# Altium project RK_MEGAPLATA.PrjPcb (part 9 of 9)
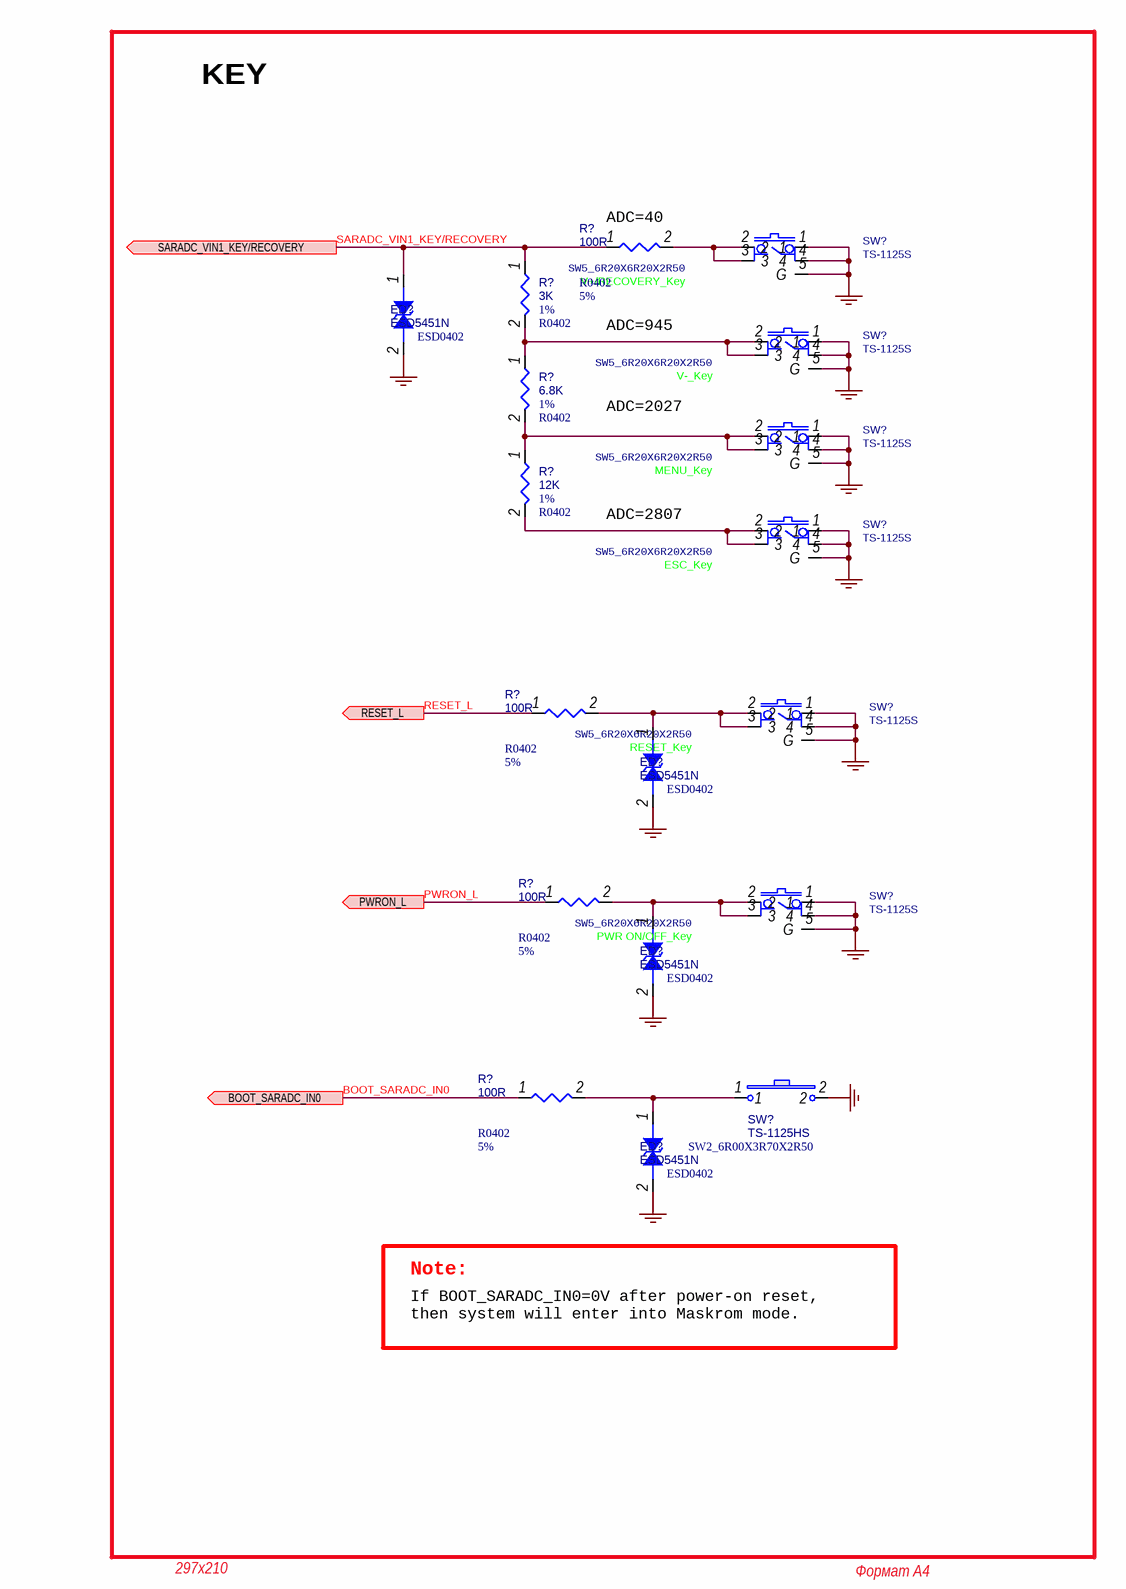
[diagram p29: BUTTON.SchDoc]

## Nets that join several sheets
(0.75-0.85V): RK3588_DDR (C?#30.1 C?#34.1 U?#3.N12 U?#4.L15), POWER_RK806 (C?#121.1 U?#23.12)
GND: RK3588_OSC_PLL (19 pins), RK3588_DDR (33 pins), RK3588_FLASH_SD_EMMC (C?#45.2 C?#46.2 C?#47.2), RK3588_TYPE_C (13 pins), RK3588_BOOTLOADER_MAYBE_SDIO (7 pins), RK3588_MIPI (9 pins), RK3588_HDMI (C?#74.2 C?#75.2 C?#76.2 R?#28.2), RK3588_GPIO_MAYBE_IMPORTANT_PINS (5 pins), UART_DEBUG (C?#82.2 ED?#1.2 ED?#2.2 J?#1.1), POWER_IN_TYPE_C (13 pins), POWER_RK806 (122 pins), PORT_TYPE_C (32 pins), DRAM_LPDDR4X_200P_2X32bit (204 pins), FLASH_EMMC (22 pins), FLASH_SD_CARD (16 pins), SD_CARD_SDIO (14 pins), HDMI2_0_RX (22 pins), MIPI_D_CPHY_TX_DUAL (33 pins), ETHERNET_PHY_RGMII (49 pins), BUTTON (23 pins)
VCC1V8_PMU_DDR_S3: RK3588_OSC_PLL (C?#8.1 C?#12.1 U?#1.N28 U?#2.R27), POWER_RK806 (R?#50.1 R?#51.1), DRAM_LPDDR4X_200P_2X32bit (34 pins), FLASH_SD_CARD (R?#113.2)
VCC_1V8_S0: RK3588_FLASH_SD_EMMC (C?#46.1 U?#6.AA7), RK3588_BOOTLOADER_MAYBE_SDIO (C?#63.1 C?#64.1 U?#9.G20 U?#11.Y26), RK3588_MIPI (C?#72.1 C?#73.1 U?#12.AJ20 U?#13.AJ19), RK3588_GPIO_MAYBE_IMPORTANT_PINS (7 pins), POWER_RK806 (C?#100.1 R?#54.1 U?#23.58), HDMI2_0_RX (R?#147.1), MIPI_D_CPHY_TX_DUAL (R?#161.1)
VCC_1V8_S3: RK3588_FLASH_SD_EMMC (C?#45.1 U?#5.V26), POWER_RK806 (7 pins), FLASH_EMMC (13 pins), SD_CARD_SDIO (10 pins)
VCC_3V3_S0: RK3588_GPIO_MAYBE_IMPORTANT_PINS (C?#78.1 C?#80.1 U?#19.AC26 U?#20.W26), POWER_RK806 (C?#148.1 U?#24.1), HDMI2_0_RX (7 pins), ETHERNET_PHY_RGMII (R?#191.1 R?#196.1)
VCC_3V3_S3: RK3588_OSC_PLL (8 pins), UART_DEBUG (C?#82.1 J?#1.4), POWER_RK806 (7 pins), PORT_TYPE_C (C?#197.1 R?#84.1 U?#32.3 U?#32.4), FLASH_EMMC (7 pins), FLASH_SD_CARD (C?#298.1 Q?#1.2 R?#110.1), MIPI_D_CPHY_TX_DUAL (C?#310.1 U?#40.5)
VCC_5V0: POWER_IN_TYPE_C (7 pins), POWER_RK806 (47 pins), PORT_TYPE_C (7 pins)
VCCA_1V8_S0: RK3588_OSC_PLL (5 pins), RK3588_DDR (C?#29.1 C?#33.1 U?#3.M12 U?#4.K16), RK3588_TYPE_C (8 pins), RK3588_BOOTLOADER_MAYBE_SDIO (C?#61.1 R?#24.2 R?#25.1 U?#10.AH18), POWER_RK806 (C?#98.1 U?#23.60)
VCCA_3V3_S0: RK3588_TYPE_C (C?#54.1 U?#8.AJ10), RK3588_HDMI (C?#75.1 C?#76.1 U?#18.AE4 U?#18.AE5), POWER_RK806 (C?#111.1 U?#23.63), PORT_TYPE_C (R?#81.2)
VCCIO_SD_S0: RK3588_FLASH_SD_EMMC (C?#47.1 U?#6.Y7), POWER_RK806 (C?#113.1 U?#23.65), FLASH_SD_CARD (6 pins)
VDD2_DDR_S3: POWER_RK806 (7 pins), DRAM_LPDDR4X_200P_2X32bit (84 pins)
VDD_0V75_S0: RK3588_OSC_PLL (C?#6.1 C?#7.1 U?#1.V20), RK3588_BOOTLOADER_MAYBE_SDIO (C?#62.1 U?#10.AD3), RK3588_MIPI (5 pins), POWER_RK806 (C?#131.1 U?#23.8)
VDD_0V75_S3: RK3588_OSC_PLL (C?#10.1 C?#11.1 U?#1.P27), POWER_RK806 (C?#116.1 U?#23.14)
VDD_DDR_S0: RK3588_DDR (22 pins), POWER_RK806 (9 pins)
VDDA_0V75_S0: RK3588_TYPE_C (C?#52.1 U?#8.AH10), RK3588_HDMI (C?#74.1 U?#18.AE8), POWER_RK806 (C?#128.1 U?#23.11)
VDDA_0V85_S0: RK3588_TYPE_C (8 pins), POWER_RK806 (C?#129.1 U?#23.10)
VDDA_1V2_S0: RK3588_MIPI (C?#70.1 C?#71.1 U?#12.AH20 U?#13.AH19), POWER_RK806 (C?#110.1 U?#23.57)
VDDQ_DDR_CK_S0: RK3588_DDR (5 pins), DRAM_LPDDR4X_200P_2X32bit (R?#93.1)
VDDQ_DDR_CKE_S3: RK3588_DDR (C?#31.1 C?#32.1 U?#3.N8 U?#4.H13), DRAM_LPDDR4X_200P_2X32bit (R?#96.1)
VDDQ_DDR_S0: RK3588_DDR (26 pins), POWER_RK806 (7 pins), DRAM_LPDDR4X_200P_2X32bit (R?#91.2 R?#93.2)
BOOT_SARADC_IN0: RK3588_BOOTLOADER_MAYBE_SDIO (C?#59.1 R?#25.2 R?#26.1 U?#10.AM16), BUTTON (R?#214.1)
CC_INT_L: RK3588_OSC_PLL (U?#2.U33), PORT_TYPE_C (R?#84.2 U?#32.5)
CPU_BIG0_VSEL: RK3588_OSC_PLL (U?#1.R31), POWER_RK806 (U?#25.A1)
CPU_BIG1_VSEL: RK3588_OSC_PLL (U?#2.W28), POWER_RK806 (U?#29.A1)
DDR_RESET: RK3588_DDR (U?#3.T4), DRAM_LPDDR4X_200P_2X32bit (C?#243.1 C?#287.1 U?#35.T11 U?#37.T11)
eMMC_RSTn: RK3588_FLASH_SD_EMMC (U?#5.AA34), FLASH_EMMC (R?#107.2 U?#39.K5)
ETH1_REFCLKO_25M: RK3588_GPIO_MAYBE_IMPORTANT_PINS (U?#20.AH27), ETHERNET_PHY_RGMII (R?#174.1)
GMAC1_MCLKINOUT: RK3588_GPIO_MAYBE_IMPORTANT_PINS (R?#35.2), ETHERNET_PHY_RGMII (C?#316.1 R?#176.1 R?#177.1)
GMAC1_MDC: RK3588_GPIO_MAYBE_IMPORTANT_PINS (U?#20.Y31), ETHERNET_PHY_RGMII (U?#41.13)
GMAC1_MDIO: RK3588_GPIO_MAYBE_IMPORTANT_PINS (R?#36.2), ETHERNET_PHY_RGMII (R?#199.2 U?#41.14)
GMAC1_RSTn_L: RK3588_GPIO_MAYBE_IMPORTANT_PINS (U?#20.AA28), ETHERNET_PHY_RGMII (R?#201.1)
GMAC1_RXCLK: RK3588_GPIO_MAYBE_IMPORTANT_PINS (U?#20.AH30), ETHERNET_PHY_RGMII (C?#335.1 R?#206.2)
GMAC1_RXD0: RK3588_GPIO_MAYBE_IMPORTANT_PINS (U?#20.AG29), ETHERNET_PHY_RGMII (R?#202.2)
GMAC1_RXD1: RK3588_GPIO_MAYBE_IMPORTANT_PINS (U?#20.AG28), ETHERNET_PHY_RGMII (R?#203.2)
GMAC1_RXD2: RK3588_GPIO_MAYBE_IMPORTANT_PINS (U?#20.AD27), ETHERNET_PHY_RGMII (R?#204.2)
GMAC1_RXD3: RK3588_GPIO_MAYBE_IMPORTANT_PINS (U?#20.AE27), ETHERNET_PHY_RGMII (R?#205.2)
GMAC1_RXDV_CRS: RK3588_GPIO_MAYBE_IMPORTANT_PINS (U?#20.AH29), ETHERNET_PHY_RGMII (R?#207.2)
GMAC1_TXCLK: RK3588_GPIO_MAYBE_IMPORTANT_PINS (R?#31.2), ETHERNET_PHY_RGMII (C?#325.1 U?#41.20)
GMAC1_TXD0: RK3588_GPIO_MAYBE_IMPORTANT_PINS (R?#32.2), ETHERNET_PHY_RGMII (U?#41.18)
GMAC1_TXD1: RK3588_GPIO_MAYBE_IMPORTANT_PINS (R?#33.2), ETHERNET_PHY_RGMII (U?#41.17)
GMAC1_TXD2: RK3588_GPIO_MAYBE_IMPORTANT_PINS (R?#29.2), ETHERNET_PHY_RGMII (U?#41.16)
GMAC1_TXD3: RK3588_GPIO_MAYBE_IMPORTANT_PINS (R?#30.2), ETHERNET_PHY_RGMII (U?#41.15)
GMAC1_TXEN: RK3588_GPIO_MAYBE_IMPORTANT_PINS (R?#34.2), ETHERNET_PHY_RGMII (U?#41.19)
HDMI_RX_CEC: RK3588_GPIO_MAYBE_IMPORTANT_PINS (U?#20.AG23), HDMI2_0_RX (Q?#7.2 R?#158.2)
HDMI_RX_SCL_M1: RK3588_GPIO_MAYBE_IMPORTANT_PINS (U?#20.AG25), HDMI2_0_RX (Q?#4.2 R?#150.2)
HDMI_RX_SDA_M1: RK3588_GPIO_MAYBE_IMPORTANT_PINS (U?#20.AG24), HDMI2_0_RX (Q?#6.2 R?#155.2)
HDMIIRX_DET_L: RK3588_BOOTLOADER_MAYBE_SDIO (U?#9.G26), HDMI2_0_RX (Q?#3.3 R?#147.2)
HDMIIRX_HPDOUT_H: RK3588_GPIO_MAYBE_IMPORTANT_PINS (U?#20.AA27), HDMI2_0_RX (R?#154.1)
I2C0_SCL_M2: RK3588_OSC_PLL (R?#8.2 U?#2.W30), POWER_RK806 (U?#25.A3 U?#29.A3)
I2C0_SDA_M2: RK3588_OSC_PLL (R?#7.2 U?#2.W29), POWER_RK806 (U?#25.B1 U?#29.B1)
I2C1_SCL_M2: RK3588_OSC_PLL (R?#13.2 U?#2.V29), POWER_RK806 (U?#26.A3)
I2C1_SDA_M2: RK3588_OSC_PLL (R?#12.2 U?#2.V28), POWER_RK806 (U?#26.B1)
I2C6_SCL_M0: RK3588_OSC_PLL (R?#15.2 U?#2.W31), PORT_TYPE_C (U?#32.6)
I2C6_SDA_M0: RK3588_OSC_PLL (R?#14.2 U?#2.V31), PORT_TYPE_C (U?#32.7)
LCD_PWREN_H: RK3588_GPIO_MAYBE_IMPORTANT_PINS (U?#21.D27), MIPI_D_CPHY_TX_DUAL (R?#162.1 R?#164.1 U?#40.4)
MIPI_DPHY0_TX_CLKN: RK3588_MIPI (U?#12.AP26), MIPI_D_CPHY_TX_DUAL (J?#7.54)
MIPI_DPHY0_TX_CLKP: RK3588_MIPI (U?#12.AN26), MIPI_D_CPHY_TX_DUAL (J?#7.53)
MIPI_DPHY0_TX_D0N: RK3588_MIPI (U?#12.AP24), MIPI_D_CPHY_TX_DUAL (J?#7.57)
MIPI_DPHY0_TX_D0P: RK3588_MIPI (U?#12.AN24), MIPI_D_CPHY_TX_DUAL (J?#7.56)
MIPI_DPHY0_TX_D1N: RK3588_MIPI (U?#12.AP25), MIPI_D_CPHY_TX_DUAL (J?#7.51)
MIPI_DPHY0_TX_D1P: RK3588_MIPI (U?#12.AN25), MIPI_D_CPHY_TX_DUAL (J?#7.50)
MIPI_DPHY0_TX_D2N: RK3588_MIPI (U?#12.AP27), MIPI_D_CPHY_TX_DUAL (J?#7.48)
MIPI_DPHY0_TX_D2P: RK3588_MIPI (U?#12.AN27), MIPI_D_CPHY_TX_DUAL (J?#7.47)
MIPI_DPHY0_TX_D3N: RK3588_MIPI (U?#12.AP28), MIPI_D_CPHY_TX_DUAL (J?#7.60)
MIPI_DPHY0_TX_D3P: RK3588_MIPI (U?#12.AN28), MIPI_D_CPHY_TX_DUAL (J?#7.59)
MIPI_DPHY1_TX_CLKN: RK3588_MIPI (U?#13.AP20), MIPI_D_CPHY_TX_DUAL (J?#7.24)
MIPI_DPHY1_TX_CLKP: RK3588_MIPI (U?#13.AN20), MIPI_D_CPHY_TX_DUAL (J?#7.23)
MIPI_DPHY1_TX_D0N: RK3588_MIPI (U?#13.AP18), MIPI_D_CPHY_TX_DUAL (J?#7.27)
MIPI_DPHY1_TX_D0P: RK3588_MIPI (U?#13.AN18), MIPI_D_CPHY_TX_DUAL (J?#7.26)
MIPI_DPHY1_TX_D1N: RK3588_MIPI (U?#13.AP19), MIPI_D_CPHY_TX_DUAL (J?#7.21)
MIPI_DPHY1_TX_D1P: RK3588_MIPI (U?#13.AN19), MIPI_D_CPHY_TX_DUAL (J?#7.20)
MIPI_DPHY1_TX_D2N: RK3588_MIPI (U?#13.AP21), MIPI_D_CPHY_TX_DUAL (J?#7.18)
MIPI_DPHY1_TX_D2P: RK3588_MIPI (U?#13.AN21), MIPI_D_CPHY_TX_DUAL (J?#7.17)
MIPI_DPHY1_TX_D3N: RK3588_MIPI (U?#13.AP22), MIPI_D_CPHY_TX_DUAL (J?#7.30)
MIPI_DPHY1_TX_D3P: RK3588_MIPI (U?#13.AN22), MIPI_D_CPHY_TX_DUAL (J?#7.29)
NetC?#185_1: RK3588_TYPE_C (U?#7.AL15), PORT_TYPE_C (C?#185.1)
NetC?#186_1: RK3588_TYPE_C (U?#7.AM15), PORT_TYPE_C (C?#186.1)
NetC?#187_1: RK3588_TYPE_C (U?#7.AN14), PORT_TYPE_C (C?#187.1)
NetC?#188_1: RK3588_TYPE_C (U?#7.AP14), PORT_TYPE_C (C?#188.1)
NetC?#189_1: RK3588_TYPE_C (U?#7.AN16), PORT_TYPE_C (C?#189.1)
NetC?#190_1: RK3588_TYPE_C (U?#7.AP16), PORT_TYPE_C (C?#190.1)
NetC?#293_1: RK3588_FLASH_SD_EMMC (R?#20.2), FLASH_EMMC (C?#293.1 U?#39.M6)
NetD?#6_1: RK3588_FLASH_SD_EMMC (R?#21.2), FLASH_SD_CARD (D?#6.1 J?#4.5 R?#116.1)
NetD?#10_1: RK3588_BOOTLOADER_MAYBE_SDIO (U?#11.AE32), SD_CARD_SDIO (D?#10.1 R?#133.1)
NetD?#11_1: RK3588_BOOTLOADER_MAYBE_SDIO (U?#11.AC33), SD_CARD_SDIO (D?#11.1 R?#134.1)
NetD?#12_1: RK3588_BOOTLOADER_MAYBE_SDIO (U?#11.AC34), SD_CARD_SDIO (D?#12.1 R?#135.1)
NetD?#13_1: RK3588_BOOTLOADER_MAYBE_SDIO (R?#27.2), SD_CARD_SDIO (D?#13.1 J?#5.5 R?#129.1)
NetD?#14_1: RK3588_BOOTLOADER_MAYBE_SDIO (U?#11.AC32), SD_CARD_SDIO (D?#14.1 R?#128.1 R?#136.1)
NetD?#15_1: RK3588_BOOTLOADER_MAYBE_SDIO (U?#11.AC31), SD_CARD_SDIO (D?#15.1 R?#127.1 R?#137.1)
NetD?#16_1: RK3588_BOOTLOADER_MAYBE_SDIO (U?#11.AB31), SD_CARD_SDIO (D?#16.1 J?#5.9 R?#126.1)
NetR?#37_1: RK3588_OSC_PLL (U?#2.R29), UART_DEBUG (R?#37.1)
NetR?#38_1: RK3588_OSC_PLL (U?#2.P29), UART_DEBUG (R?#38.1)
NetR?#69_1: RK3588_GPIO_MAYBE_IMPORTANT_PINS (U?#19.AL27), PORT_TYPE_C (R?#69.1)
NetR?#72_1: RK3588_GPIO_MAYBE_IMPORTANT_PINS (U?#19.AM27), PORT_TYPE_C (R?#72.1)
NetR?#73_1: RK3588_TYPE_C (U?#8.AM12), PORT_TYPE_C (R?#73.1)
NetR?#75_1: RK3588_TYPE_C (U?#8.AL12), PORT_TYPE_C (R?#75.1)
NetR?#77_1: RK3588_TYPE_C (U?#7.AP13), PORT_TYPE_C (R?#77.1)
NetR?#78_1: RK3588_TYPE_C (U?#7.AN13), PORT_TYPE_C (R?#78.1)
NetR?#79_1: RK3588_TYPE_C (U?#7.AP15), PORT_TYPE_C (R?#79.1)
NetR?#80_1: RK3588_TYPE_C (U?#7.AN15), PORT_TYPE_C (R?#80.1)
NetR?#81_1: RK3588_TYPE_C (U?#8.AM14), PORT_TYPE_C (R?#81.1)
NetR?#82_1: RK3588_GPIO_MAYBE_IMPORTANT_PINS (U?#19.AL30), PORT_TYPE_C (R?#82.1 U?#33.4)
NetR?#85_1: RK3588_DDR (U?#3.P7), DRAM_LPDDR4X_200P_2X32bit (R?#85.1)
NetR?#86_1: RK3588_DDR (U?#3.N7), DRAM_LPDDR4X_200P_2X32bit (R?#86.1)
NetR?#87_1: RK3588_DDR (U?#3.L5), DRAM_LPDDR4X_200P_2X32bit (R?#87.1)
NetR?#88_1: RK3588_DDR (U?#3.L4), DRAM_LPDDR4X_200P_2X32bit (R?#88.1)
NetR?#97_1: RK3588_DDR (U?#4.D11), DRAM_LPDDR4X_200P_2X32bit (R?#97.1)
NetR?#98_1: RK3588_DDR (U?#4.E11), DRAM_LPDDR4X_200P_2X32bit (R?#98.1)
NetR?#99_1: RK3588_DDR (U?#4.D16), DRAM_LPDDR4X_200P_2X32bit (R?#99.1)
NetR?#100_1: RK3588_DDR (U?#4.E16), DRAM_LPDDR4X_200P_2X32bit (R?#100.1)
NetR?#108_1: RK3588_FLASH_SD_EMMC (U?#5.Y34), FLASH_EMMC (R?#108.1)
NetR?#138_2: RK3588_HDMI (U?#18.AF5), HDMI2_0_RX (R?#138.2)
NetR?#139_2: RK3588_HDMI (U?#18.AF6), HDMI2_0_RX (R?#139.2)
NetR?#140_2: RK3588_HDMI (U?#18.AG4), HDMI2_0_RX (R?#140.2)
NetR?#141_2: RK3588_HDMI (U?#18.AG5), HDMI2_0_RX (R?#141.2)
NetR?#142_2: RK3588_HDMI (U?#18.AH5), HDMI2_0_RX (R?#142.2)
NetR?#143_2: RK3588_HDMI (U?#18.AH6), HDMI2_0_RX (R?#143.2)
NetR?#144_2: RK3588_HDMI (U?#18.AJ4), HDMI2_0_RX (R?#144.2)
NetR?#145_2: RK3588_HDMI (U?#18.AJ5), HDMI2_0_RX (R?#145.2)
NetU?#3_AA1: RK3588_DDR (U?#3.AA1), DRAM_LPDDR4X_200P_2X32bit (U?#35.C9)
NetU?#3_AA2: RK3588_DDR (U?#3.AA2), DRAM_LPDDR4X_200P_2X32bit (U?#35.B9)
NetU?#3_AA4: RK3588_DDR (U?#3.AA4), DRAM_LPDDR4X_200P_2X32bit (U?#35.E10)
NetU?#3_AA5: RK3588_DDR (U?#3.AA5), DRAM_LPDDR4X_200P_2X32bit (U?#35.D10)
NetU?#3_AB1: RK3588_DDR (U?#3.AB1), DRAM_LPDDR4X_200P_2X32bit (U?#35.C11)
NetU?#3_AB2: RK3588_DDR (U?#3.AB2), DRAM_LPDDR4X_200P_2X32bit (U?#35.B11)
NetU?#3_AB4: RK3588_DDR (U?#3.AB4), DRAM_LPDDR4X_200P_2X32bit (U?#35.C10)
NetU?#3_AC1: RK3588_DDR (U?#3.AC1), DRAM_LPDDR4X_200P_2X32bit (U?#35.E11)
NetU?#3_AC2: RK3588_DDR (U?#3.AC2), DRAM_LPDDR4X_200P_2X32bit (U?#35.F11)
NetU?#3_B1: RK3588_DDR (U?#3.B1), DRAM_LPDDR4X_200P_2X32bit (U?#35.U11)
NetU?#3_C1: RK3588_DDR (U?#3.C1), DRAM_LPDDR4X_200P_2X32bit (U?#35.Y11)
NetU?#3_C2: RK3588_DDR (U?#3.C2), DRAM_LPDDR4X_200P_2X32bit (U?#35.V11)
NetU?#3_D1: RK3588_DDR (U?#3.D1), DRAM_LPDDR4X_200P_2X32bit (U?#35.AA9)
NetU?#3_D2: RK3588_DDR (U?#3.D2), DRAM_LPDDR4X_200P_2X32bit (U?#35.AA11)
NetU?#3_E1: RK3588_DDR (U?#3.E1), DRAM_LPDDR4X_200P_2X32bit (U?#35.V9)
NetU?#3_E2: RK3588_DDR (U?#3.E2), DRAM_LPDDR4X_200P_2X32bit (U?#35.Y9)
NetU?#3_E4: RK3588_DDR (U?#3.E4), DRAM_LPDDR4X_200P_2X32bit (U?#35.Y10)
NetU?#3_F1: RK3588_DDR (U?#3.F1), DRAM_LPDDR4X_200P_2X32bit (U?#35.U4)
NetU?#3_F2: RK3588_DDR (U?#3.F2), DRAM_LPDDR4X_200P_2X32bit (U?#35.U9)
NetU?#3_F4: RK3588_DDR (U?#3.F4), DRAM_LPDDR4X_200P_2X32bit (U?#35.V10)
NetU?#3_F5: RK3588_DDR (U?#3.F5), DRAM_LPDDR4X_200P_2X32bit (U?#35.W10)
NetU?#3_G1: RK3588_DDR (U?#3.G1), DRAM_LPDDR4X_200P_2X32bit (U?#35.Y4)
NetU?#3_G2: RK3588_DDR (U?#3.G2), DRAM_LPDDR4X_200P_2X32bit (U?#35.V4)
NetU?#3_G4: RK3588_DDR (U?#3.G4), DRAM_LPDDR4X_200P_2X32bit (U?#35.Y3)
NetU?#3_H1: RK3588_DDR (U?#3.H1), DRAM_LPDDR4X_200P_2X32bit (U?#35.AA2)
NetU?#3_H2: RK3588_DDR (U?#3.H2), DRAM_LPDDR4X_200P_2X32bit (U?#35.AA4)
NetU?#3_J1: RK3588_DDR (U?#3.J1), DRAM_LPDDR4X_200P_2X32bit (U?#35.V2)
NetU?#3_J2: RK3588_DDR (U?#3.J2), DRAM_LPDDR4X_200P_2X32bit (U?#35.Y2)
NetU?#3_J7: RK3588_DDR (U?#3.J7), DRAM_LPDDR4X_200P_2X32bit (U?#35.V3)
NetU?#3_J8: RK3588_DDR (U?#3.J8), DRAM_LPDDR4X_200P_2X32bit (U?#35.W3)
NetU?#3_K1: RK3588_DDR (U?#3.K1), DRAM_LPDDR4X_200P_2X32bit (U?#35.R11)
NetU?#3_K2: RK3588_DDR (U?#3.K2), DRAM_LPDDR4X_200P_2X32bit (U?#35.U2)
NetU?#3_L2: RK3588_DDR (U?#3.L2), DRAM_LPDDR4X_200P_2X32bit (U?#35.P11)
NetU?#3_L7: RK3588_DDR (U?#3.L7), DRAM_LPDDR4X_200P_2X32bit (U?#35.R4)
NetU?#3_L8: RK3588_DDR (U?#3.L8), DRAM_LPDDR4X_200P_2X32bit (U?#35.R3)
NetU?#3_M1: RK3588_DDR (U?#3.M1), DRAM_LPDDR4X_200P_2X32bit (U?#35.P9)
NetU?#3_M2: RK3588_DDR (U?#3.M2), DRAM_LPDDR4X_200P_2X32bit (U?#35.P8)
NetU?#3_M5: RK3588_DDR (U?#3.M5), DRAM_LPDDR4X_200P_2X32bit (U?#35.P2)
NetU?#3_M8: RK3588_DDR (U?#3.M8), DRAM_LPDDR4X_200P_2X32bit (U?#35.R2)
NetU?#3_N1: RK3588_DDR (U?#3.N1), DRAM_LPDDR4X_200P_2X32bit (U?#35.J9)
NetU?#3_N2: RK3588_DDR (U?#3.N2), DRAM_LPDDR4X_200P_2X32bit (U?#35.J8)
NetU?#3_N4: RK3588_DDR (U?#3.N4), DRAM_LPDDR4X_200P_2X32bit (U?#35.R10)
NetU?#3_N5: RK3588_DDR (U?#3.N5), DRAM_LPDDR4X_200P_2X32bit (U?#35.R9)
NetU?#3_P2: RK3588_DDR (U?#3.P2), DRAM_LPDDR4X_200P_2X32bit (U?#35.J11)
NetU?#3_P4: RK3588_DDR (U?#3.P4), DRAM_LPDDR4X_200P_2X32bit (U?#35.H9)
NetU?#3_P5: RK3588_DDR (U?#3.P5), DRAM_LPDDR4X_200P_2X32bit (U?#35.H10)
NetU?#3_R1: RK3588_DDR (U?#3.R1), DRAM_LPDDR4X_200P_2X32bit (U?#35.H11)
NetU?#3_R2: RK3588_DDR (U?#3.R2), DRAM_LPDDR4X_200P_2X32bit (U?#35.F2)
NetU?#3_R6: RK3588_DDR (U?#3.R6), DRAM_LPDDR4X_200P_2X32bit (U?#35.H4)
NetU?#3_R7: RK3588_DDR (U?#3.R7), DRAM_LPDDR4X_200P_2X32bit (U?#35.H3)
NetU?#3_T1: RK3588_DDR (U?#3.T1), DRAM_LPDDR4X_200P_2X32bit (U?#35.E2)
NetU?#3_T2: RK3588_DDR (U?#3.T2), DRAM_LPDDR4X_200P_2X32bit (U?#35.C2)
NetU?#3_T7: RK3588_DDR (U?#3.T7), DRAM_LPDDR4X_200P_2X32bit (U?#35.H2)
NetU?#3_T8: RK3588_DDR (U?#3.T8), DRAM_LPDDR4X_200P_2X32bit (U?#35.J2)
NetU?#3_U1: RK3588_DDR (U?#3.U1), DRAM_LPDDR4X_200P_2X32bit (U?#35.B2)
NetU?#3_U2: RK3588_DDR (U?#3.U2), DRAM_LPDDR4X_200P_2X32bit (U?#35.B4)
NetU?#3_U4: RK3588_DDR (U?#3.U4), DRAM_LPDDR4X_200P_2X32bit (U?#35.E3)
NetU?#3_U5: RK3588_DDR (U?#3.U5), DRAM_LPDDR4X_200P_2X32bit (U?#35.D3)
NetU?#3_V1: RK3588_DDR (U?#3.V1), DRAM_LPDDR4X_200P_2X32bit (U?#35.C4)
NetU?#3_V2: RK3588_DDR (U?#3.V2), DRAM_LPDDR4X_200P_2X32bit (U?#35.E4)
NetU?#3_W1: RK3588_DDR (U?#3.W1), DRAM_LPDDR4X_200P_2X32bit (U?#35.F4)
NetU?#3_Y1: RK3588_DDR (U?#3.Y1), DRAM_LPDDR4X_200P_2X32bit (U?#35.F9)
NetU?#3_Y2: RK3588_DDR (U?#3.Y2), DRAM_LPDDR4X_200P_2X32bit (U?#35.E9)
NetU?#3_Y4: RK3588_DDR (U?#3.Y4), DRAM_LPDDR4X_200P_2X32bit (U?#35.C3)
NetU?#4_A2: RK3588_DDR (U?#4.A2), DRAM_LPDDR4X_200P_2X32bit (U?#37.E11)
NetU?#4_A3: RK3588_DDR (U?#4.A3), DRAM_LPDDR4X_200P_2X32bit (U?#37.B11)
NetU?#4_A4: RK3588_DDR (U?#4.A4), DRAM_LPDDR4X_200P_2X32bit (U?#37.C9)
NetU?#4_A5: RK3588_DDR (U?#4.A5), DRAM_LPDDR4X_200P_2X32bit (U?#37.F9)
NetU?#4_A6: RK3588_DDR (U?#4.A6), DRAM_LPDDR4X_200P_2X32bit (U?#37.F4)
NetU?#4_A7: RK3588_DDR (U?#4.A7), DRAM_LPDDR4X_200P_2X32bit (U?#37.C4)
NetU?#4_A8: RK3588_DDR (U?#4.A8), DRAM_LPDDR4X_200P_2X32bit (U?#37.B2)
NetU?#4_A9: RK3588_DDR (U?#4.A9), DRAM_LPDDR4X_200P_2X32bit (U?#37.E2)
NetU?#4_A10: RK3588_DDR (U?#4.A10), DRAM_LPDDR4X_200P_2X32bit (U?#37.H11)
NetU?#4_A12: RK3588_DDR (U?#4.A12), DRAM_LPDDR4X_200P_2X32bit (U?#37.J9)
NetU?#4_A13: RK3588_DDR (U?#4.A13), DRAM_LPDDR4X_200P_2X32bit (U?#37.P9)
NetU?#4_A15: RK3588_DDR (U?#4.A15), DRAM_LPDDR4X_200P_2X32bit (U?#37.R11)
NetU?#4_A16: RK3588_DDR (U?#4.A16), DRAM_LPDDR4X_200P_2X32bit (U?#37.V2)
NetU?#4_A17: RK3588_DDR (U?#4.A17), DRAM_LPDDR4X_200P_2X32bit (U?#37.AA2)
NetU?#4_A18: RK3588_DDR (U?#4.A18), DRAM_LPDDR4X_200P_2X32bit (U?#37.Y4)
NetU?#4_A19: RK3588_DDR (U?#4.A19), DRAM_LPDDR4X_200P_2X32bit (U?#37.U4)
NetU?#4_A20: RK3588_DDR (U?#4.A20), DRAM_LPDDR4X_200P_2X32bit (U?#37.U9)
NetU?#4_A21: RK3588_DDR (U?#4.A21), DRAM_LPDDR4X_200P_2X32bit (U?#37.Y9)
NetU?#4_A22: RK3588_DDR (U?#4.A22), DRAM_LPDDR4X_200P_2X32bit (U?#37.AA11)
NetU?#4_A23: RK3588_DDR (U?#4.A23), DRAM_LPDDR4X_200P_2X32bit (U?#37.V11)
NetU?#4_B2: RK3588_DDR (U?#4.B2), DRAM_LPDDR4X_200P_2X32bit (U?#37.F11)
NetU?#4_B3: RK3588_DDR (U?#4.B3), DRAM_LPDDR4X_200P_2X32bit (U?#37.C11)
NetU?#4_B4: RK3588_DDR (U?#4.B4), DRAM_LPDDR4X_200P_2X32bit (U?#37.B9)
NetU?#4_B5: RK3588_DDR (U?#4.B5), DRAM_LPDDR4X_200P_2X32bit (U?#37.E9)
NetU?#4_B7: RK3588_DDR (U?#4.B7), DRAM_LPDDR4X_200P_2X32bit (U?#37.E4)
NetU?#4_B8: RK3588_DDR (U?#4.B8), DRAM_LPDDR4X_200P_2X32bit (U?#37.B4)
NetU?#4_B9: RK3588_DDR (U?#4.B9), DRAM_LPDDR4X_200P_2X32bit (U?#37.C2)
NetU?#4_B10: RK3588_DDR (U?#4.B10), DRAM_LPDDR4X_200P_2X32bit (U?#37.F2)
NetU?#4_B11: RK3588_DDR (U?#4.B11), DRAM_LPDDR4X_200P_2X32bit (U?#37.J11)
NetU?#4_B12: RK3588_DDR (U?#4.B12), DRAM_LPDDR4X_200P_2X32bit (U?#37.J8)
NetU?#4_B13: RK3588_DDR (U?#4.B13), DRAM_LPDDR4X_200P_2X32bit (U?#37.P8)
NetU?#4_B14: RK3588_DDR (U?#4.B14), DRAM_LPDDR4X_200P_2X32bit (U?#37.P11)
NetU?#4_B15: RK3588_DDR (U?#4.B15), DRAM_LPDDR4X_200P_2X32bit (U?#37.U2)
NetU?#4_B16: RK3588_DDR (U?#4.B16), DRAM_LPDDR4X_200P_2X32bit (U?#37.Y2)
NetU?#4_B17: RK3588_DDR (U?#4.B17), DRAM_LPDDR4X_200P_2X32bit (U?#37.AA4)
NetU?#4_B18: RK3588_DDR (U?#4.B18), DRAM_LPDDR4X_200P_2X32bit (U?#37.V4)
NetU?#4_B20: RK3588_DDR (U?#4.B20), DRAM_LPDDR4X_200P_2X32bit (U?#37.V9)
NetU?#4_B21: RK3588_DDR (U?#4.B21), DRAM_LPDDR4X_200P_2X32bit (U?#37.AA9)
NetU?#4_B22: RK3588_DDR (U?#4.B22), DRAM_LPDDR4X_200P_2X32bit (U?#37.Y11)
NetU?#4_B23: RK3588_DDR (U?#4.B23), DRAM_LPDDR4X_200P_2X32bit (U?#37.U11)
NetU?#4_D4: RK3588_DDR (U?#4.D4), DRAM_LPDDR4X_200P_2X32bit (U?#37.C10)
NetU?#4_D5: RK3588_DDR (U?#4.D5), DRAM_LPDDR4X_200P_2X32bit (U?#37.E10)
NetU?#4_D9: RK3588_DDR (U?#4.D9), DRAM_LPDDR4X_200P_2X32bit (U?#37.E3)
NetU?#4_D13: RK3588_DDR (U?#4.D13), DRAM_LPDDR4X_200P_2X32bit (U?#37.H10)
NetU?#4_D19: RK3588_DDR (U?#4.D19), DRAM_LPDDR4X_200P_2X32bit (U?#37.R3)
NetU?#4_D20: RK3588_DDR (U?#4.D20), DRAM_LPDDR4X_200P_2X32bit (U?#37.Y3)
NetU?#4_D21: RK3588_DDR (U?#4.D21), DRAM_LPDDR4X_200P_2X32bit (U?#37.W10)
NetU?#4_D22: RK3588_DDR (U?#4.D22), DRAM_LPDDR4X_200P_2X32bit (U?#37.Y10)
NetU?#4_E5: RK3588_DDR (U?#4.E5), DRAM_LPDDR4X_200P_2X32bit (U?#37.D10)
NetU?#4_E9: RK3588_DDR (U?#4.E9), DRAM_LPDDR4X_200P_2X32bit (U?#37.D3)
NetU?#4_E13: RK3588_DDR (U?#4.E13), DRAM_LPDDR4X_200P_2X32bit (U?#37.H9)
NetU?#4_E14: RK3588_DDR (U?#4.E14), DRAM_LPDDR4X_200P_2X32bit (U?#37.R10)
NetU?#4_E19: RK3588_DDR (U?#4.E19), DRAM_LPDDR4X_200P_2X32bit (U?#37.R4)
NetU?#4_E21: RK3588_DDR (U?#4.E21), DRAM_LPDDR4X_200P_2X32bit (U?#37.V10)
NetU?#4_F8: RK3588_DDR (U?#4.F8), DRAM_LPDDR4X_200P_2X32bit (U?#37.C3)
NetU?#4_F12: RK3588_DDR (U?#4.F12), DRAM_LPDDR4X_200P_2X32bit (U?#37.J2)
NetU?#4_G11: RK3588_DDR (U?#4.G11), DRAM_LPDDR4X_200P_2X32bit (U?#37.H4)
NetU?#4_G12: RK3588_DDR (U?#4.G12), DRAM_LPDDR4X_200P_2X32bit (U?#37.H2)
NetU?#4_G13: RK3588_DDR (U?#4.G13), DRAM_LPDDR4X_200P_2X32bit (U?#37.R9)
NetU?#4_G14: RK3588_DDR (U?#4.G14), DRAM_LPDDR4X_200P_2X32bit (U?#37.P2)
NetU?#4_G16: RK3588_DDR (U?#4.G16), DRAM_LPDDR4X_200P_2X32bit (U?#37.V3)
NetU?#4_H11: RK3588_DDR (U?#4.H11), DRAM_LPDDR4X_200P_2X32bit (U?#37.H3)
NetU?#4_H15: RK3588_DDR (U?#4.H15), DRAM_LPDDR4X_200P_2X32bit (U?#37.R2)
NetU?#4_H16: RK3588_DDR (U?#4.H16), DRAM_LPDDR4X_200P_2X32bit (U?#37.W3)
NetU?#5_AA32: RK3588_FLASH_SD_EMMC (U?#5.AA32), FLASH_EMMC (U?#39.B4)
NetU?#5_AA33: RK3588_FLASH_SD_EMMC (U?#5.AA33), FLASH_EMMC (U?#39.B2)
NetU?#5_V32: RK3588_FLASH_SD_EMMC (U?#5.V32), FLASH_EMMC (U?#39.A5)
NetU?#5_V33: RK3588_FLASH_SD_EMMC (U?#5.V33), FLASH_EMMC (U?#39.B6)
NetU?#5_W32: RK3588_FLASH_SD_EMMC (U?#5.W32), FLASH_EMMC (U?#39.B5)
NetU?#5_W33: RK3588_FLASH_SD_EMMC (U?#5.W33), FLASH_EMMC (U?#39.A4)
NetU?#5_W34: RK3588_FLASH_SD_EMMC (U?#5.W34), FLASH_EMMC (U?#39.M5)
NetU?#5_Y32: RK3588_FLASH_SD_EMMC (U?#5.Y32), FLASH_EMMC (U?#39.B3)
NetU?#5_Y33: RK3588_FLASH_SD_EMMC (U?#5.Y33), FLASH_EMMC (U?#39.A3)
NPU_VSEL: RK3588_OSC_PLL (U?#2.U32), POWER_RK806 (U?#26.A1)
PMIC_INT_L: RK3588_OSC_PLL (U?#1.M30), POWER_RK806 (R?#65.2 U?#28.19)
PMIC_PWR_CTRL1: RK3588_OSC_PLL (U?#1.R32), POWER_RK806 (U?#28.62)
PMIC_PWR_CTRL2: RK3588_OSC_PLL (R?#9.2 R?#10.1), POWER_RK806 (U?#28.61)
PMIC_PWR_CTRL3: RK3588_OSC_PLL (R?#6.2 R?#11.1), POWER_RK806 (U?#28.16)
PMIC_SPI_CLK: RK3588_OSC_PLL (R?#4.2), POWER_RK806 (U?#28.17)
PMIC_SPI_CS: RK3588_OSC_PLL (U?#1.K30), POWER_RK806 (R?#62.1 U?#28.18)
PMIC_SPI_MOSI: RK3588_OSC_PLL (R?#5.2 U?#1.L29), POWER_RK806 (R?#63.1 U?#28.15)
PWRON_L: POWER_RK806 (C?#183.1 U?#28.4), BUTTON (R?#213.1)
RESET_L: RK3588_OSC_PLL (C?#1.1 R?#3.1 U?#1.M31), POWER_RK806 (C?#182.1 R?#66.2 U?#28.40), BUTTON (R?#212.1)
SARADC_VIN1_KEY/RECOVERY: RK3588_BOOTLOADER_MAYBE_SDIO (C?#60.1 R?#24.1 U?#10.AL16), BUTTON (ED?#21.1 R?#208.1 R?#209.1)
SDMMC0_CMD: RK3588_FLASH_SD_EMMC (U?#6.AE2), FLASH_SD_CARD (R?#122.1)
SDMMC0_D0: RK3588_FLASH_SD_EMMC (U?#6.AD2), FLASH_SD_CARD (R?#123.1)
SDMMC0_D1: RK3588_FLASH_SD_EMMC (U?#6.AD1), FLASH_SD_CARD (R?#124.1)
SDMMC0_D2: RK3588_FLASH_SD_EMMC (U?#6.AF2), FLASH_SD_CARD (R?#120.1)
SDMMC0_D3: RK3588_FLASH_SD_EMMC (U?#6.AF1), FLASH_SD_CARD (R?#121.1)
SDMMC_DET_L: RK3588_OSC_PLL (U?#1.P31), FLASH_SD_CARD (R?#113.1 R?#125.1)
SDMMC_PWREN: RK3588_OSC_PLL (U?#2.T28), FLASH_SD_CARD (R?#112.1)